# Altium schematic sheet 02_CV25_SOM.SchDoc
size A4; SheetNumber: 2; SheetTotal: 5
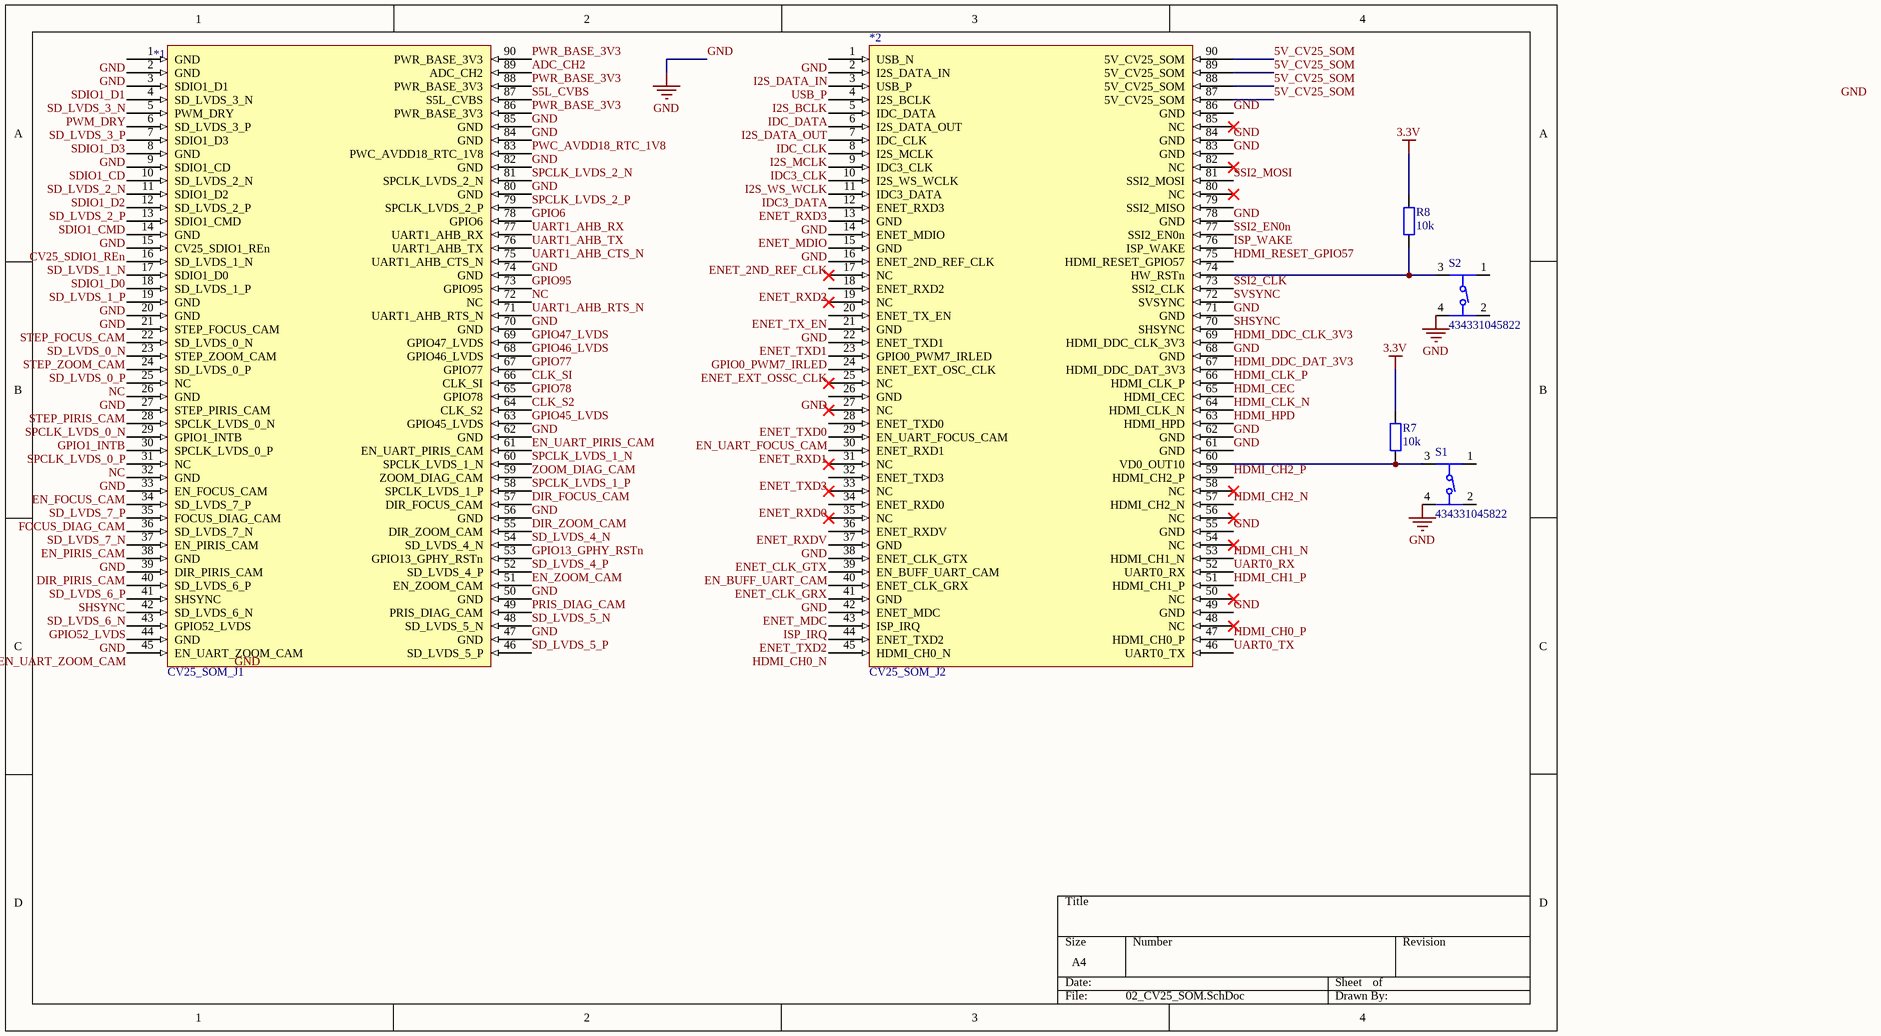
[diagram p0: 02_CV25_SOM.SchDoc]

## Parts
*1  CV25_SOM_J1  [HIROSE_DF40C-90DS-0.4V(51)]
*2  CV25_SOM_J2  [HIROSE_DF40C-90DS-0.4V(51)]
R7  10k  [tro smd 0603]
R8  10k  [tro smd 0603]
S1  434331045822  [4343X10458XX]
S2  434331045822  [4343X10458XX]

## Nets
3.3V: R7.2 R8.2
GND: *1.1(GND) *1.2(GND) *1.8(GND) *1.14(GND) *1.19(GND) *1.20(GND) *1.26(GND) *1.32(GND) *1.38(GND) *1.44(GND) *1.47(GND) *1.50(GND) *1.56(GND) *1.62(GND) *1.70(GND) *1.74(GND) *1.80(GND) *1.82(GND) *1.84(GND) *1.85(GND) *2.1(USB_N) *2.13(GND) *2.15(GND) *2.21(GND) *2.26(GND) *2.37(GND) *2.41(GND) *2.49(GND) *2.55(GND) *2.61(GND) *2.62(GND) *2.68(GND) *2.71(GND) *2.78(GND) *2.83(GND) *2.84(GND) *2.86(GND) S1.4 S2.4
5V_CV25_SOM: *2.87(5V_CV25_SOM) *2.88(5V_CV25_SOM) *2.89(5V_CV25_SOM) *2.90(5V_CV25_SOM)
ADC_CH2: *1.89(ADC_CH2)
CLK_S2: *1.64(CLK_S2)
CLK_SI: *1.66(CLK_SI)
CV25_SDIO1_REn: *1.15(CV25_SDIO1_REn)
DIR_FOCUS_CAM: *1.57(DIR_FOCUS_CAM)
DIR_PIRIS_CAM: *1.39(DIR_PIRIS_CAM)
DIR_ZOOM_CAM: *1.55(DIR_ZOOM_CAM)
EN_BUFF_UART_CAM: *2.39(EN_BUFF_UART_CAM)
EN_FOCUS_CAM: *1.33(EN_FOCUS_CAM)
EN_PIRIS_CAM: *1.37(EN_PIRIS_CAM)
EN_UART_FOCUS_CAM: *2.29(EN_UART_FOCUS_CAM)
EN_UART_PIRIS_CAM: *1.61(EN_UART_PIRIS_CAM)
EN_UART_ZOOM_CAM: *1.45(EN_UART_ZOOM_CAM)
EN_ZOOM_CAM: *1.51(EN_ZOOM_CAM)
ENET_2ND_REF_CLK: *2.16(ENET_2ND_REF_CLK)
ENET_CLK_GRX: *2.40(ENET_CLK_GRX)
ENET_CLK_GTX: *2.38(ENET_CLK_GTX)
ENET_EXT_OSSC_CLK: *2.24(ENET_EXT_OSC_CLK)
ENET_MDC: *2.42(ENET_MDC)
ENET_MDIO: *2.14(ENET_MDIO)
ENET_RXD0: *2.34(ENET_RXD0)
ENET_RXD1: *2.30(ENET_RXD1)
ENET_RXD2: *2.18(ENET_RXD2)
ENET_RXD3: *2.12(ENET_RXD3)
ENET_RXDV: *2.36(ENET_RXDV)
ENET_TX_EN: *2.20(ENET_TX_EN)
ENET_TXD0: *2.28(ENET_TXD0)
ENET_TXD1: *2.22(ENET_TXD1)
ENET_TXD2: *2.44(ENET_TXD2)
ENET_TXD3: *2.32(ENET_TXD3)
FOCUS_DIAG_CAM: *1.35(FOCUS_DIAG_CAM)
GPIO0_PWM7_IRLED: *2.23(GPIO0_PWM7_IRLED)
GPIO1_INTB: *1.29(GPIO1_INTB)
GPIO6: *1.78(GPIO6)
GPIO13_GPHY_RSTn: *1.53(GPIO13_GPHY_RSTn)
GPIO45_LVDS: *1.63(GPIO45_LVDS)
GPIO46_LVDS: *1.68(GPIO46_LVDS)
GPIO47_LVDS: *1.69(GPIO47_LVDS)
GPIO52_LVDS: *1.43(GPIO52_LVDS)
GPIO77: *1.67(GPIO77)
GPIO78: *1.65(GPIO78)
GPIO95: *1.73(GPIO95)
HDMI_CEC: *2.65(HDMI_CEC)
HDMI_CH0_N: *2.45(HDMI_CH0_N)
HDMI_CH0_P: *2.47(HDMI_CH0_P)
HDMI_CH1_N: *2.53(HDMI_CH1_N)
HDMI_CH1_P: *2.51(HDMI_CH1_P)
HDMI_CH2_N: *2.57(HDMI_CH2_N)
HDMI_CH2_P: *2.59(HDMI_CH2_P)
HDMI_CLK_N: *2.64(HDMI_CLK_N)
HDMI_CLK_P: *2.66(HDMI_CLK_P)
HDMI_DDC_CLK_3V3: *2.69(HDMI_DDC_CLK_3V3)
HDMI_DDC_DAT_3V3: *2.67(HDMI_DDC_DAT_3V3)
HDMI_HPD: *2.63(HDMI_HPD)
HDMI_RESET_GPIO57: *2.75(HDMI_RESET_GPIO57)
I2S_BCLK: *2.4(I2S_BCLK)
I2S_DATA_IN: *2.2(I2S_DATA_IN)
I2S_DATA_OUT: *2.6(I2S_DATA_OUT)
I2S_MCLK: *2.8(I2S_MCLK)
I2S_WS_WCLK: *2.10(I2S_WS_WCLK)
IDC3_CLK: *2.9(IDC3_CLK)
IDC3_DATA: *2.11(IDC3_DATA)
IDC_CLK: *2.7(IDC_CLK)
IDC_DATA: *2.5(IDC_DATA)
ISP_IRQ: *2.43(ISP_IRQ)
ISP_WAKE: *2.76(ISP_WAKE)
NC: *1.25(NC) *1.31(NC) *1.72(NC)
PRIS_DIAG_CAM: *1.49(PRIS_DIAG_CAM)
PWC_AVDD18_RTC_1V8: *1.83(PWC_AVDD18_RTC_1V8)
PWM_DRY: *1.5(PWM_DRY)
PWR_BASE_3V3: *1.86(PWR_BASE_3V3) *1.88(PWR_BASE_3V3) *1.90(PWR_BASE_3V3)
S5L_CVBS: *1.87(S5L_CVBS)
SD_LVDS_0_N: *1.22(SD_LVDS_0_N)
SD_LVDS_0_P: *1.24(SD_LVDS_0_P)
SD_LVDS_1_N: *1.16(SD_LVDS_1_N)
SD_LVDS_1_P: *1.18(SD_LVDS_1_P)
SD_LVDS_2_N: *1.10(SD_LVDS_2_N)
SD_LVDS_2_P: *1.12(SD_LVDS_2_P)
SD_LVDS_3_N: *1.4(SD_LVDS_3_N)
SD_LVDS_3_P: *1.6(SD_LVDS_3_P)
SD_LVDS_4_N: *1.54(SD_LVDS_4_N)
SD_LVDS_4_P: *1.52(SD_LVDS_4_P)
SD_LVDS_5_N: *1.48(SD_LVDS_5_N)
SD_LVDS_5_P: *1.46(SD_LVDS_5_P)
SD_LVDS_6_N: *1.42(SD_LVDS_6_N)
SD_LVDS_6_P: *1.40(SD_LVDS_6_P)
SD_LVDS_7_N: *1.36(SD_LVDS_7_N)
SD_LVDS_7_P: *1.34(SD_LVDS_7_P)
SDIO1_CD: *1.9(SDIO1_CD)
SDIO1_CMD: *1.13(SDIO1_CMD)
SDIO1_D0: *1.17(SDIO1_D0)
SDIO1_D1: *1.3(SDIO1_D1)
SDIO1_D2: *1.11(SDIO1_D2)
SDIO1_D3: *1.7(SDIO1_D3)
SHSYNC: *1.41(SHSYNC) *2.70(SHSYNC)
SPCLK_LVDS_0_N: *1.28(SPCLK_LVDS_0_N)
SPCLK_LVDS_0_P: *1.30(SPCLK_LVDS_0_P)
SPCLK_LVDS_1_N: *1.60(SPCLK_LVDS_1_N)
SPCLK_LVDS_1_P: *1.58(SPCLK_LVDS_1_P)
SPCLK_LVDS_2_N: *1.81(SPCLK_LVDS_2_N)
SPCLK_LVDS_2_P: *1.79(SPCLK_LVDS_2_P)
SSI2_CLK: *2.73(SSI2_CLK)
SSI2_EN0n: *2.77(SSI2_EN0n)
SSI2_MOSI: *2.81(SSI2_MOSI)
STEP_FOCUS_CAM: *1.21(STEP_FOCUS_CAM)
STEP_PIRIS_CAM: *1.27(STEP_PIRIS_CAM)
STEP_ZOOM_CAM: *1.23(STEP_ZOOM_CAM)
SVSYNC: *2.72(SVSYNC)
UART0_RX: *2.52(UART0_RX)
UART0_TX: *2.46(UART0_TX)
UART1_AHB_CTS_N: *1.75(UART1_AHB_CTS_N)
UART1_AHB_RTS_N: *1.71(UART1_AHB_RTS_N)
UART1_AHB_RX: *1.77(UART1_AHB_RX)
UART1_AHB_TX: *1.76(UART1_AHB_TX)
USB_P: *2.3(USB_P)
ZOOM_DIAG_CAM: *1.59(ZOOM_DIAG_CAM)
Net*2_60: *2.60(VD0_OUT10) R7.1 S1.3
Net*2_74: *2.74(HW_RSTn) R8.1 S2.3

Not connected (* = marked no-connect by the designer): *2 17(NC)* 19(NC)* 25(NC)* 27(NC)* 31(NC)* 33(NC)* 35(NC)* 48(NC)* 50(NC)* 54(NC)* 56(NC)* 58(NC)* 79(SSI2_MISO) 80(NC)* 82(NC)* 85(NC)*; S1 1(3) 2(4); S2 1(3) 2(4)

## Notes on the sheet
- Labels drawn without touching a wire or pin: GND

## Library data of the parts
R7 R8 = Tro 0603 1% 10k: Dán; Don_Vi: Con; So_Chan: 2; Ten_Linh_Kien: Trở 0603 1% 10k; Ma_Hang: MH006333; Chung_Loai: Dán; Kieu_Chan: *
S1 S2 = 434331045822: MF: {'manufacturer': u'W\xfcrth Elektronik'}; Package: None; Price: None; Value: *; MP: 434331045822; Availability: Unavailable